# EAGLE design SimulatorT1-T2-AdapterRevB (EAGLE 7.7.0)
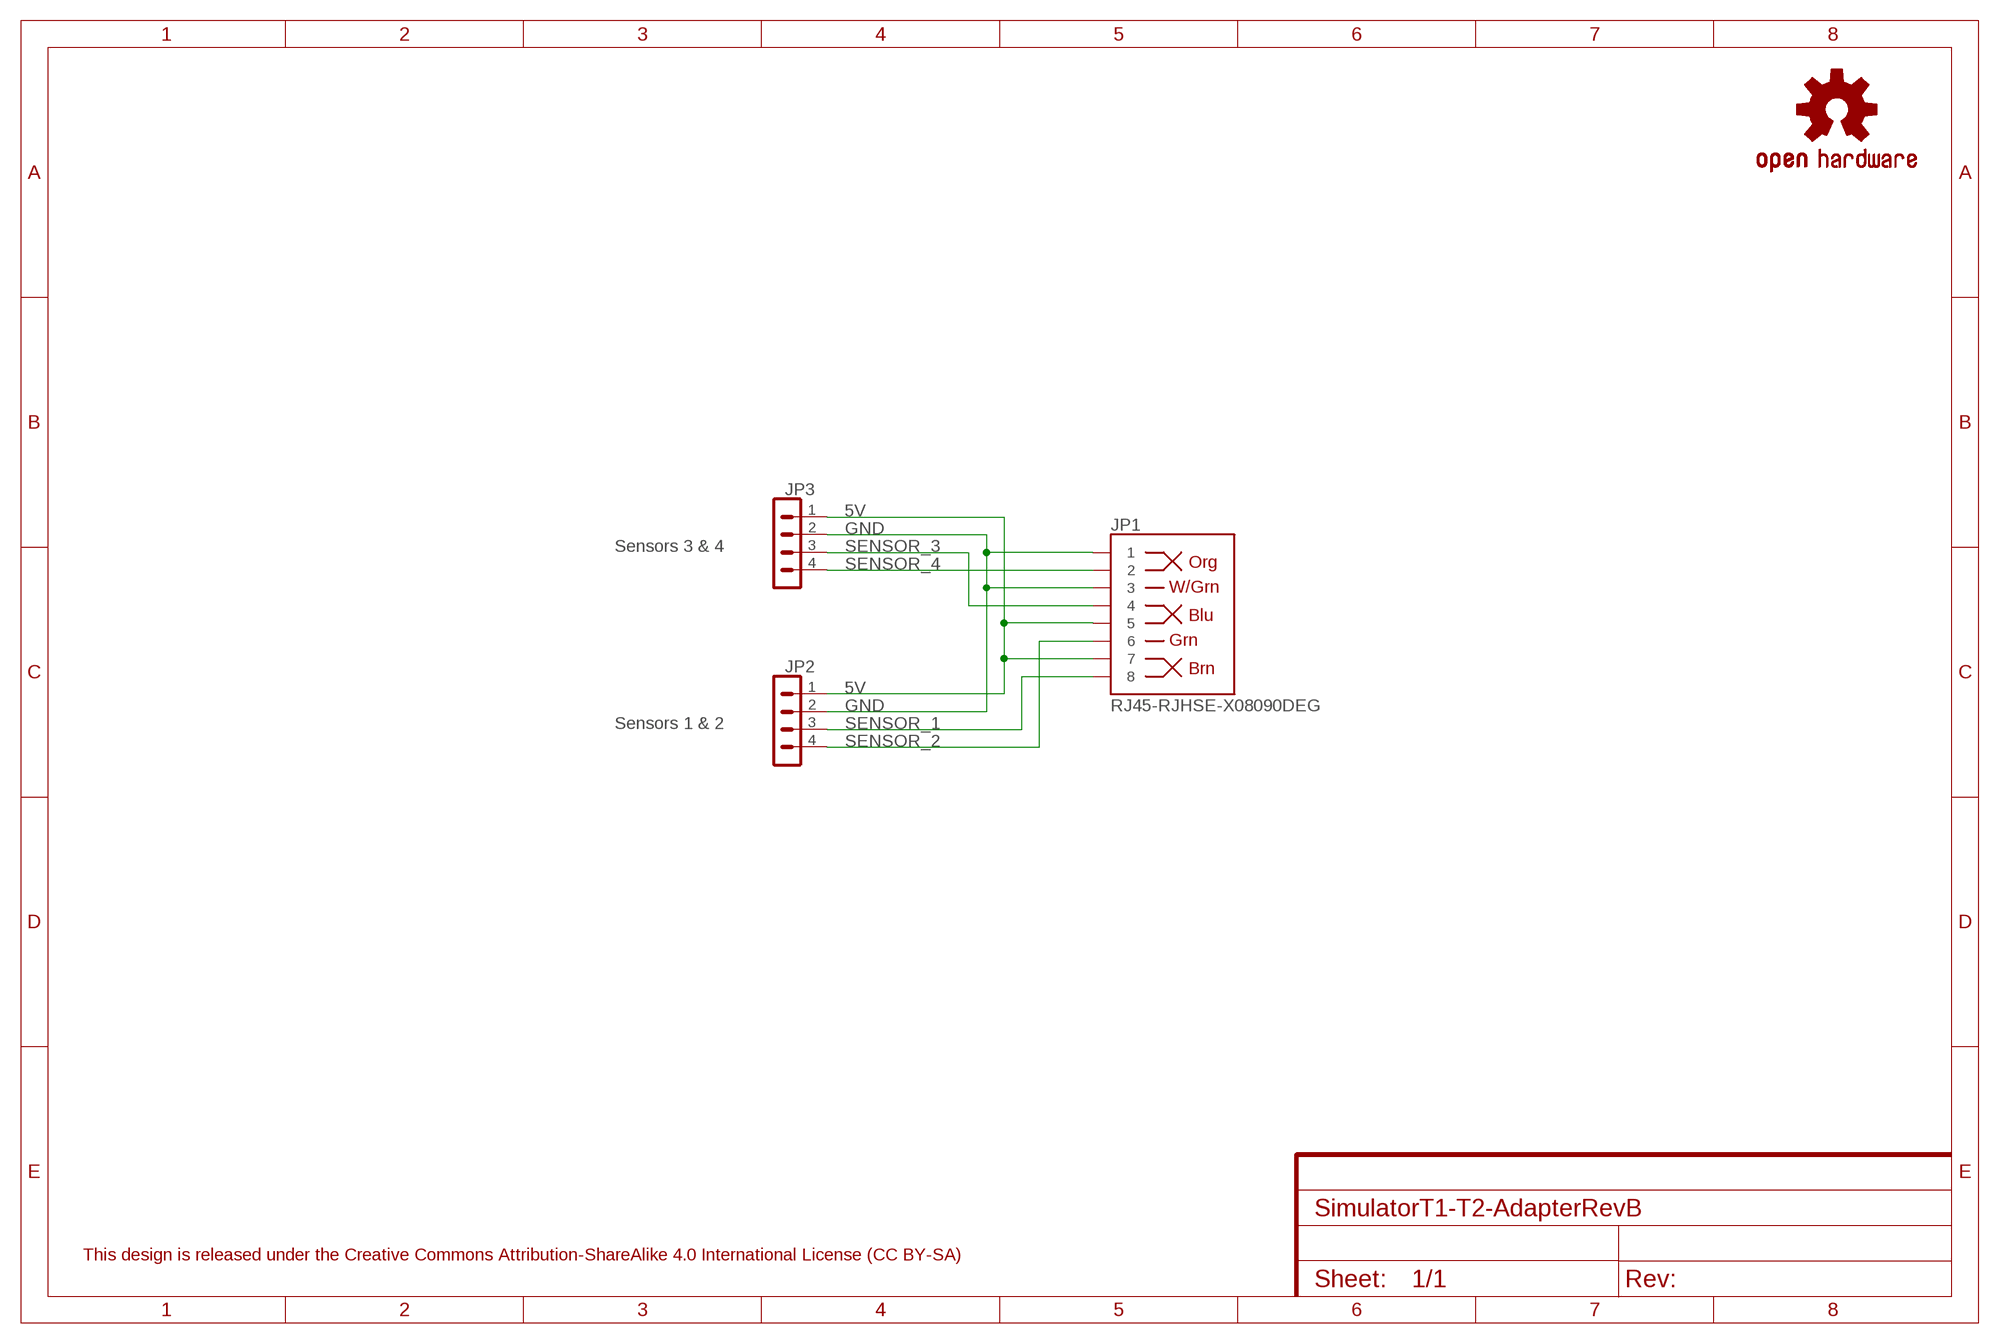
[diagram p0: schematic, sheet 1]
FRAME1 (FRAME-A4L): CNAME: Liverpool Simulator Type 1-Type 2 Adapter; CREVISION: Rev B 02/2025; DESIGNER: A J Instone-Cowie

## Parts
JP1  RJ45-RJHSE-X08090DEG  [RJ45-RJHSE-5080]
JP2  MOLEX_KK_254_4WAY  [MOLEX_KK_254_4WAY]
JP3  MOLEX_KK_254_4WAY  [MOLEX_KK_254_4WAY]
LOGO1  OSHW-LOGOS  [OSHW-LOGO-S]

## Nets
5V: JP1.5 JP1.7 JP2.1 JP3.1
GND: JP1.1 JP1.3 JP2.2 JP3.2
SENSOR_1: JP1.8 JP2.3
SENSOR_2: JP1.6 JP2.4
SENSOR_3: JP1.4 JP3.3
SENSOR_4: JP1.2 JP3.4

## Notes on the sheet
- Sensors 3 & 4
- Sensors 1 & 2
- This design is released under the Creative Commons Attribution-ShareAlike 4.0 International License (CC BY-SA)

## Library data of the parts
JP1 = AIC_Custom:RJ45-RJHSE-X080: Amphenol RJHSE-x080 RJ45 PCB Jack RJ45 8-pin connection PCB PTH connector, 90 degree and vertical mounting packages
JP2 JP3 = AIC_Custom:MOLEX_KK_254_4WAY: Molex KK 254 Type Connector, Right Angle
LOGO1 = SparkFun-Aesthetics:OSHW-LOGO: Open Source Hardware Logo This logo indicates the piece of hardware it is found on incorporates a OSHW license and/or adheres to the definition of open source hardware found here: http://freedomdefined.org/OSHW

## Board
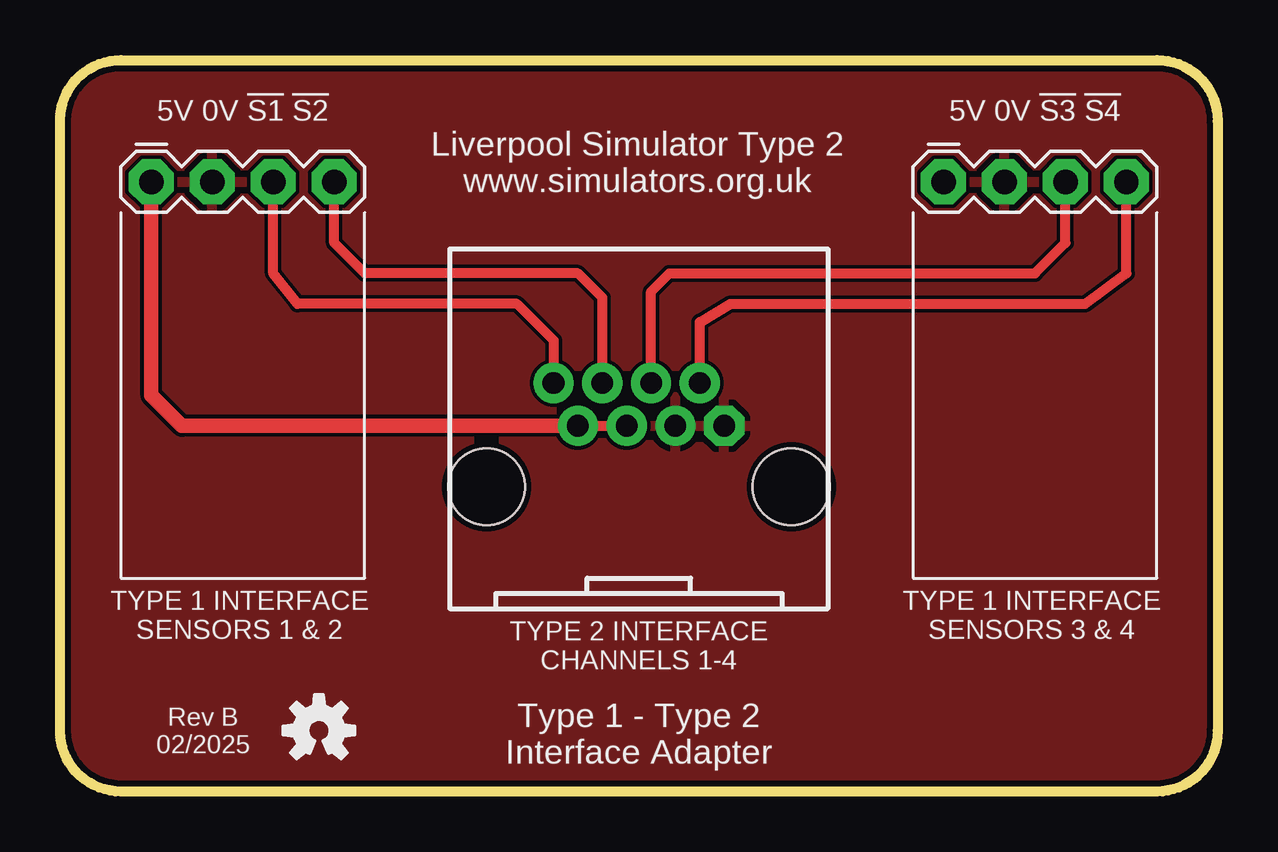
[diagram p1: board, top side]
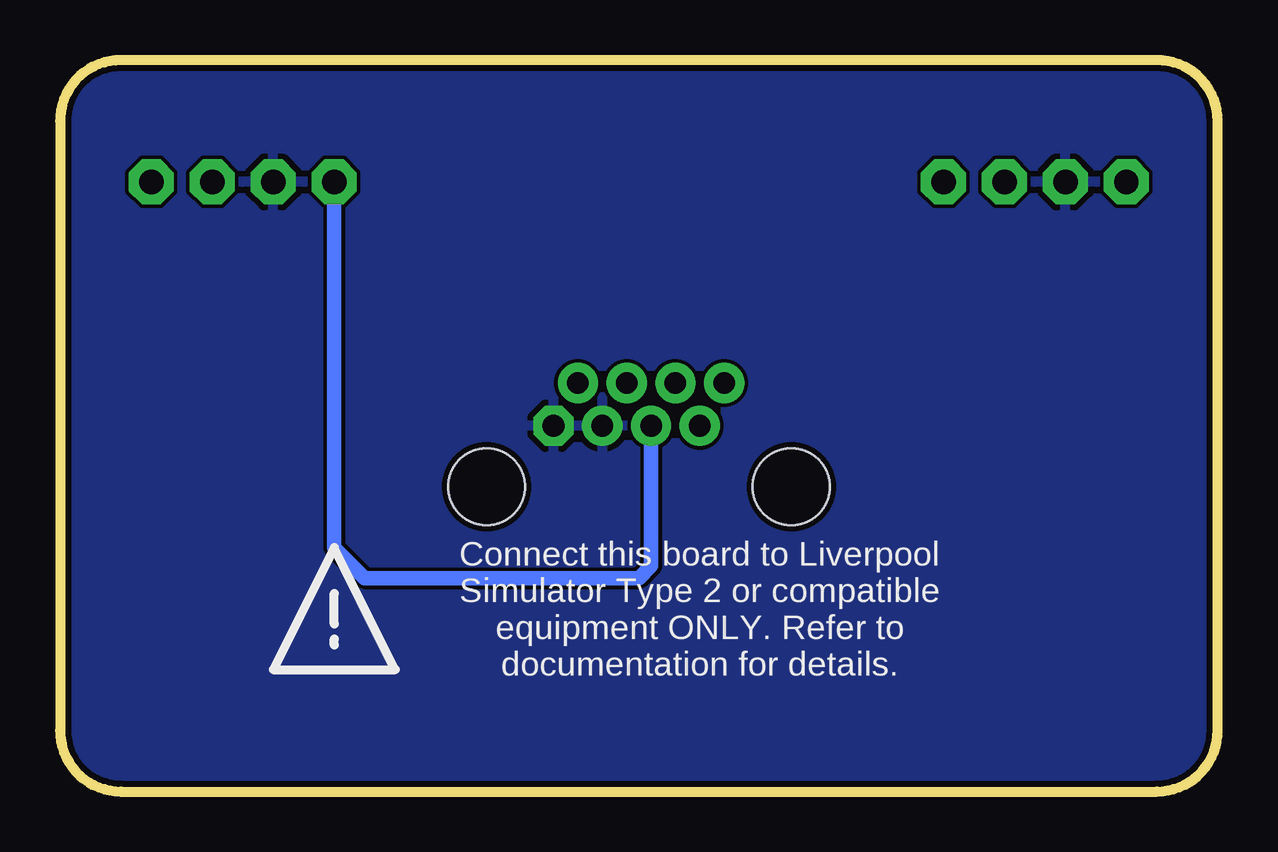
[diagram p2: board, bottom side, seen from below]

Size 48.26 x 30.48 mm. Coordinates in mm from the lower left corner, seen from the top.
Outline: 2.54,30.48 45.72,30.48 arc-90 48.26,27.94 48.26,2.54 arc-90 45.72,0 2.54,0 arc-90 0,2.54 0,27.94 arc-90 2.54,30.48
Copper layers (1*16): Top 0.035mm / dielectric 1.5mm / Bottom 0.035mm
Design rules "SeeedStudio_2layer_DRU_no_angle_20140221": minimum track width 6mil, minimum drill 12mil, track to track 6mil, track to pad 6mil, pad to pad 6mil, via to via 6mil, smd to smd 0mil, copper to edge 10mil, drill to drill 10mil, minimum pad ring 10mil, minimum via ring 6mil, stop-mask expansion 2mil, vias tented up to drill 100mil, thermal gap 10mil

### Footprints (pad centres in the part's own frame; a part is rotated, then mirrored left to right if it is on the bottom)
RJ45-RJHSE-5080 = drill 0.9 pad 1.676 octagon: 1 3.556,2.54 | drill 0.9 pad 1.676: 2 2.54,4.318; 3 1.524,2.54; 4 0.508,4.318; 5 -0.508,2.54; 6 -1.524,4.318; 7 -2.54,2.54; 8 -3.556,4.318 | hole 3.2: -6.35,0; 6.35,0
MOLEX_KK_254_4WAY = drill 1.016 pad 1.88 octagon: 1 -3.81,-1.27; 2 -1.27,-1.27; 3 1.27,-1.27; 4 3.81,-1.27

### Placement (x,y rotation side)
JP1  24.13,12.7 0 top
JP2  7.62,26.67 0 top
JP3  40.64,26.67 0 top
LOGO1  10.79,2.54 0 top
U$1  [WARNING_TRIANGLE_TPLACE]  36.83,5.08 0 bottom

### Tracks (layer width: path | path; a pad name or v marks a point on that pad's centre or on a via)
5V
  Top 0.406: JP1.7 JP1.5
  Top 0.61: JP1.7 5.08,15.24 3.81,16.51 JP2.1
  Bottom 0.61: JP3.1 36.83,10.16 35.56,8.89 24.13,8.89 23.62,9.4 JP1.5
GND
  pour Top: 2.54,30.48 45.72,30.48 arc-90 48.26,27.94 48.26,2.54 arc-90 45.72,0 2.54,0 arc-90 0,2.54 0,27.94 arc-90
  pour Bottom: 2.54,30.48 45.72,30.48 arc-90 48.26,27.94 48.26,2.54 arc-90 45.72,0 2.54,0 arc-90 0,2.54 0,27.94 arc-90
SENSOR_1
  Top 0.406: JP2.3 8.89,21.59 9.91,20.32 19.05,20.32 20.57,18.8 JP1.8
SENSOR_2
  Top 0.406: JP1.6 22.61,20.57 21.59,21.59 12.7,21.59 11.43,22.86 JP2.4
SENSOR_3
  Top 0.406: JP1.4 24.64,20.83 25.4,21.59 40.64,21.59 41.91,22.86 JP3.3
SENSOR_4
  Top 0.406: JP1.2 26.67,19.56 27.94,20.32 42.74,20.32 44.45,21.59 JP3.4

### Text on the board
tPlace: 5V 0V !S1! !S2! | 5V 0V !S3! !S4! | Liverpool Simulator Type 2 / www.simulators.org.uk | TYPE 1 INTERFACE / SENSORS 1 & 2 | TYPE 1 INTERFACE / SENSORS 3 & 4 | TYPE 2 INTERFACE / CHANNELS 1-4 | Rev B / 02/2025 | Type 1 - Type 2 / Interface Adapter
bPlace: Connect this board to Liverpool / Simulator Type 2 or compatible / equipment ONLY. Refer to / documentation for details.